# EAGLE design vibration (EAGLE 7.2.0)
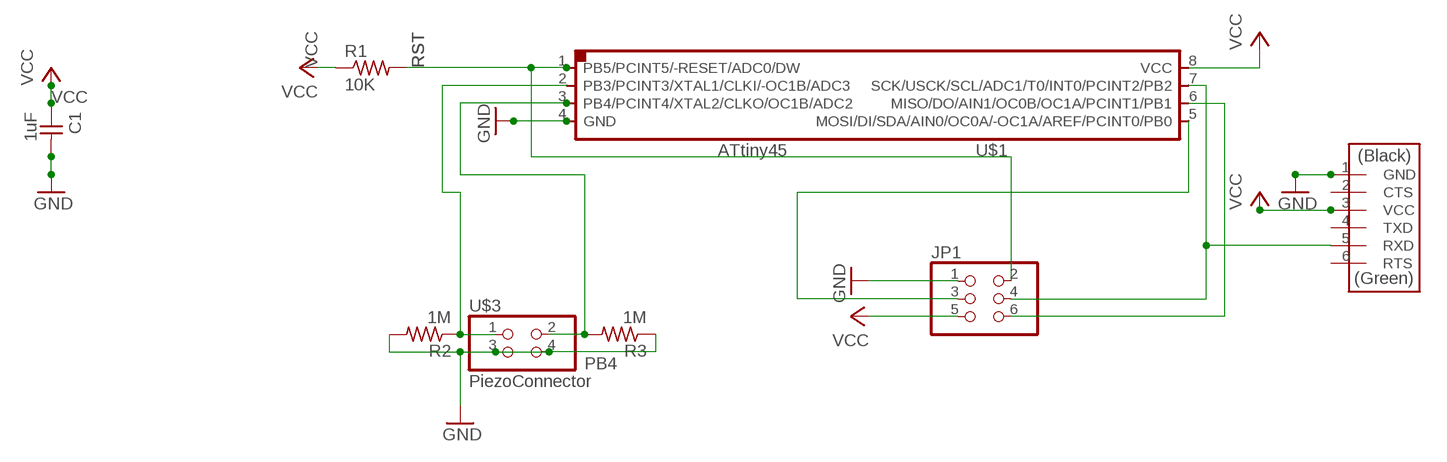
[diagram p0: schematic, sheet 1]

## Parts
C1  1uF  CAP-UNPOLARIZEDFAB  [C1206FAB]
JP1  PINHD-2X3-SMD  [2X03SMD]
R1  10K  RES-US1206FAB  [R1206FAB]
R2  1M  RES-US1206FAB  [R1206FAB]
R3  1M  RES-US1206FAB  [R1206FAB]
U$1  ATTINY45SI  [SOIC8]
U$2  FTDI-SMD-HEADER  [1X06SMD]
U$3  PiezoConnector  PINHD-2X2-SMD  [2X02SMD]

## Nets
GND: C1.2 JP1.1 R2.2 R3.1 U$1.4(GND) U$2.1(GND) U$3.3 U$3.4
N$1: R2.1 U$1.2(PB3/PCINT3/XTAL1/CLKI/-OC1B/ADC3) U$3.1
N$2: JP1.6 U$1.6(MISO/DO/AIN1/OC0B/OC1A/PCINT1/PB1)
N$3: JP1.4 U$1.7(SCK/USCK/SCL/ADC1/T0/INT0/PCINT2/PB2) U$2.5(RXD)
N$4: JP1.3 U$1.5(MOSI/DI/SDA/AIN0/OC0A/-OC1A/AREF/PCINT0/PB0)
PB4: R3.2 U$1.3(PB4/PCINT4/XTAL2/CLKO/OC1B/ADC2) U$3.2
RST: JP1.2 R1.2 U$1.1(PB5/PCINT5/-RESET/ADC0/DW)
VCC: C1.1 JP1.5 R1.1 U$1.8(VCC) U$2.3(VCC)
Unconnected: U$2.2(CTS) U$2.4(TXD) U$2.6(RTS)

## Library data of the parts
C1 = fab:CAP-UNPOLARIZED
JP1 = fab:PINHD-2X3-SMD: PIN HEADER
R1-R3 = fab:RES-US: Resistor (US Symbol) Variants with postfix FAB are widened to allow the routing of internal traces
U$1 = fab:ATTINY45
U$2 = fab:FTDI-SMD-HEADER
U$3 = fab:PINHD-2X2-SMD

## Board
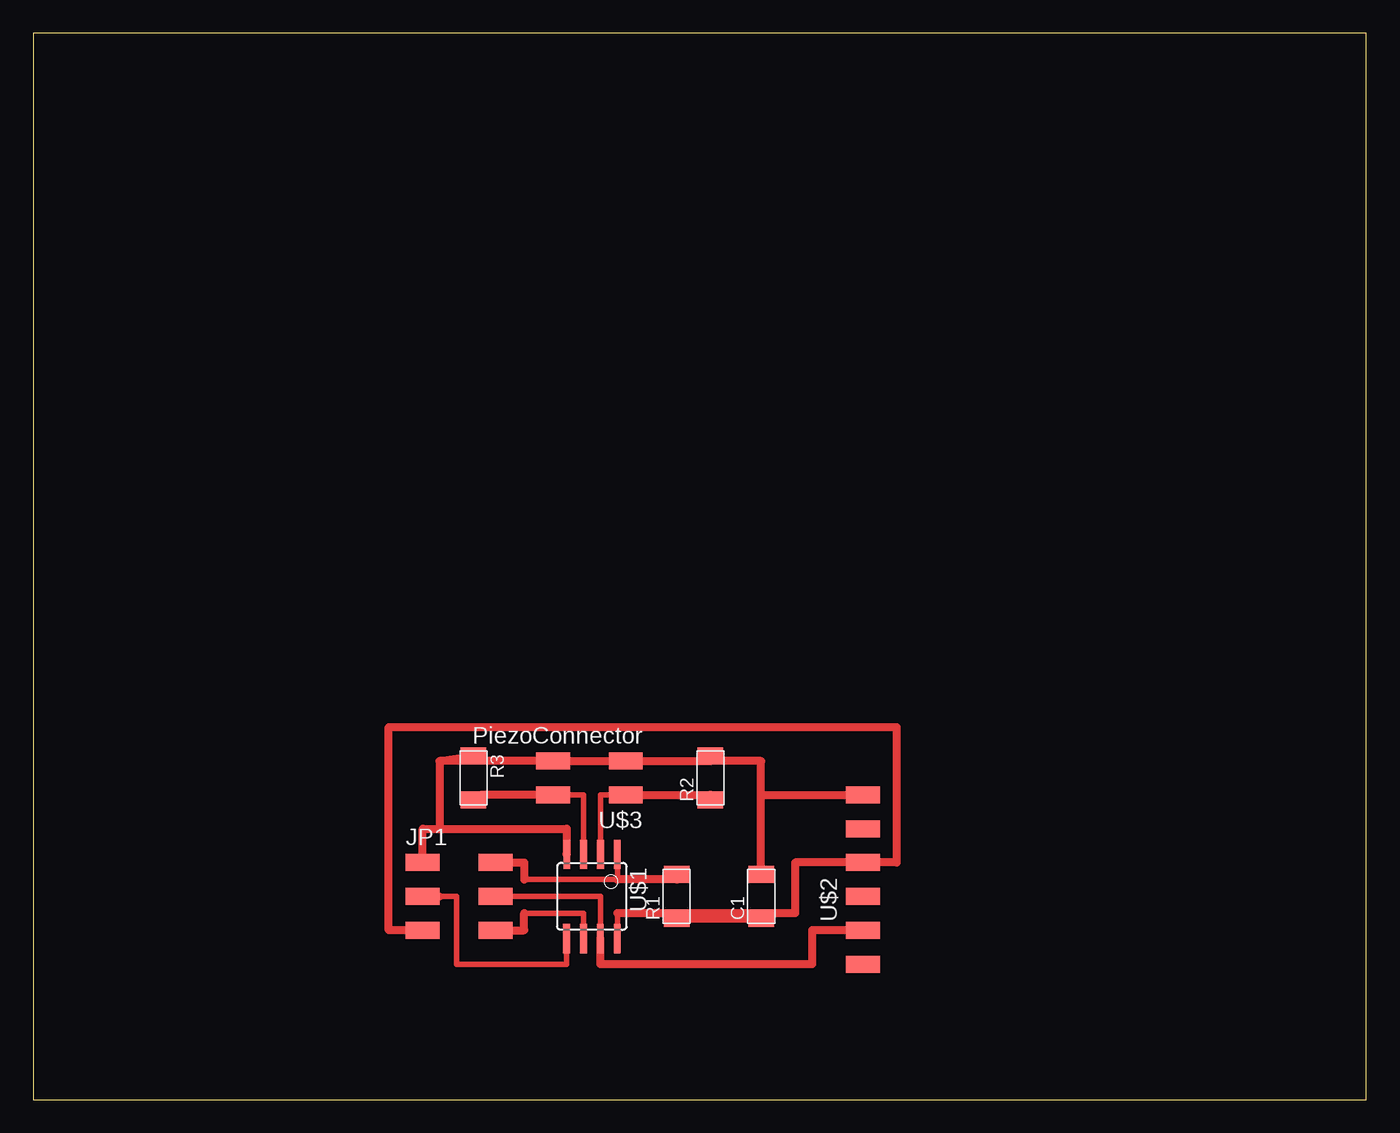
[diagram p1: board, top side]

Size 100 x 80 mm. Coordinates in mm from the lower left corner, seen from the top.
Outline: 0,0 100,0 100,80 0,80 0,0
Copper layers (1*16): Top 0.035mm / dielectric 1.5mm / Bottom 0.035mm
Design rules "default": minimum track width 10mil, minimum drill 24mil, track to track 8mil, track to pad 8mil, pad to pad 8mil, via to via 8mil, smd to smd 8mil, copper to edge 40mil, drill to drill 8mil, minimum pad ring 10mil, minimum via ring 8mil, stop-mask expansion 4mil, vias tented up to drill 0mil, thermal gap 10mil

### Footprints (pad centres in the part's own frame; a part is rotated, then mirrored left to right if it is on the bottom)
C1206FAB = smd 1.27 x 1.905: 1 -1.651,0; 2 1.651,0
2X03SMD = smd 2.54 x 1.27: 1 -2.54,2.54; 2 2.92,2.54; 3 -2.54,0; 4 2.92,0; 5 -2.54,-2.54; 6 2.92,-2.54
R1206FAB = smd 1.27 x 1.905: 1 -1.651,0; 2 1.651,0
SOIC8 = smd 0.5 x 2.2: 1 -1.905,-3.154; 2 -0.645,-3.154; 3 0.625,-3.154; 4 1.895,-3.154; 5 1.905,3.154; 6 0.635,3.154; 7 -0.635,3.154; 8 -1.905,3.154
1X06SMD = smd 2.54 x 1.27: 1 0,6.35; 2 0,3.81; 3 0,1.27; 4 0,-1.27; 5 0,-3.81; 6 0,-6.35
2X02SMD = smd 2.54 x 1.27: 1 -2.54,1.27; 2 2.92,1.27; 3 -2.54,-1.27; 4 2.92,-1.27

### Placement (x,y rotation side)
C1  54.61,15.24 90 top
JP1  31.75,15.24 0 top
R1  48.26,15.24 90 top
R2  50.8,24.13 90 top
R3  33.02,24.13 270 top
U$1  41.91,15.24 180 top
U$2  62.23,16.51 0 top
U$3  41.91,24.13 180 top

### Tracks (layer width: path | path; a pad name or v marks a point on that pad's centre or on a via)
GND
  Top 0.61: JP1.1 29.21,20.32 30.48,20.32 | 30.48,20.32 40.02,20.32 U$1.4 | C1.2 54.61,22.86 | 54.61,22.86 U$2.1 | 30.48,25.4 U$3.4 U$3.3 50.16,25.4 50.8,25.4 | 30.48,25.4 30.48,20.32 | 30.48,25.4 R3.1 | 50.8,25.4 R2.2 | 54.61,22.86 54.61,25.4 50.8,25.4
N$1
  Top 0.406: U$1.2 42.55,22.86 U$3.1
  Top 0.61: U$3.1 50.8,22.86 R2.1
N$2
  Top 0.406: 36.83,13.97 41.27,13.97 U$1.6
  Top 0.61: JP1.6 36.83,12.7 36.83,13.97
N$3
  Top 0.406: JP1.4 42.55,15.24 U$1.7
  Top 0.61: U$2.5 58.42,12.7 58.42,10.16 42.55,10.16 U$1.7
N$4
  Top 0.406: 30.48,15.24 31.75,15.24 31.75,10.16 40.01,10.16 U$1.5
  Top 0.61: JP1.3 30.48,15.24
PB4
  Top 0.406: U$1.3 41.28,22.86 U$3.2
  Top 0.61: U$3.2 33.66,22.86 R3.2
RST
  Top 0.406: 36.83,16.51 43.81,16.51 U$1.1 | 48.26,16.51 R1.2
  Top 0.61: JP1.2 36.83,17.78 36.83,16.51 | 48.26,16.51 43.81,16.51
VCC
  Top 0.406: U$1.8 43.81,13.97
  Top 0.61: 48.26,13.97 57.15,13.97 57.15,17.78 U$2.3 64.77,17.78 64.77,27.94 26.67,27.94 26.67,12.7 JP1.5 | 48.26,13.97 R1.1 C1.1 | 48.26,13.97 43.81,13.97